# EAGLE board ebook_reader (EAGLE 9.7.0)
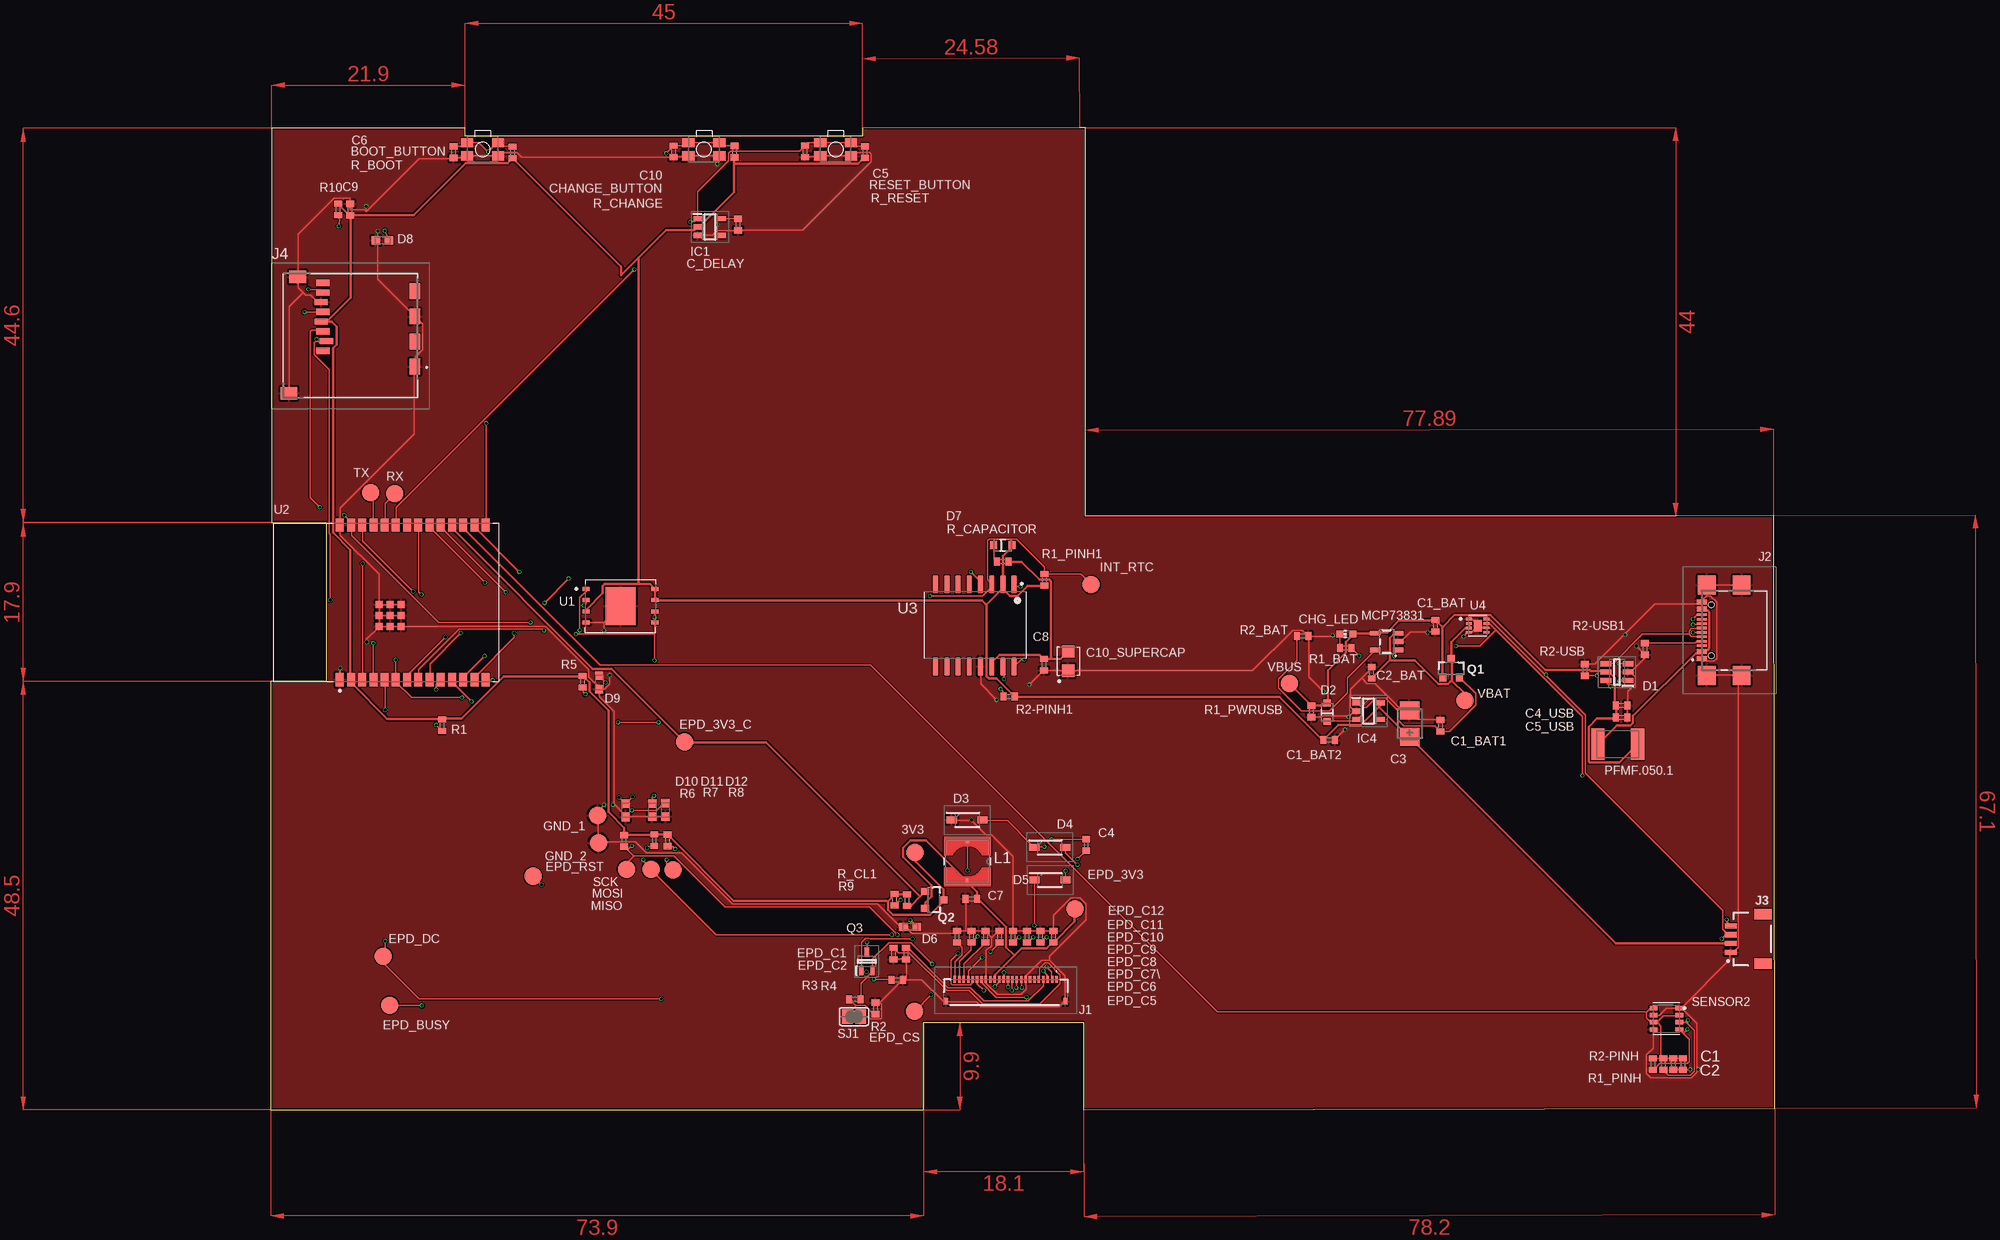
[diagram p1: board, top side]
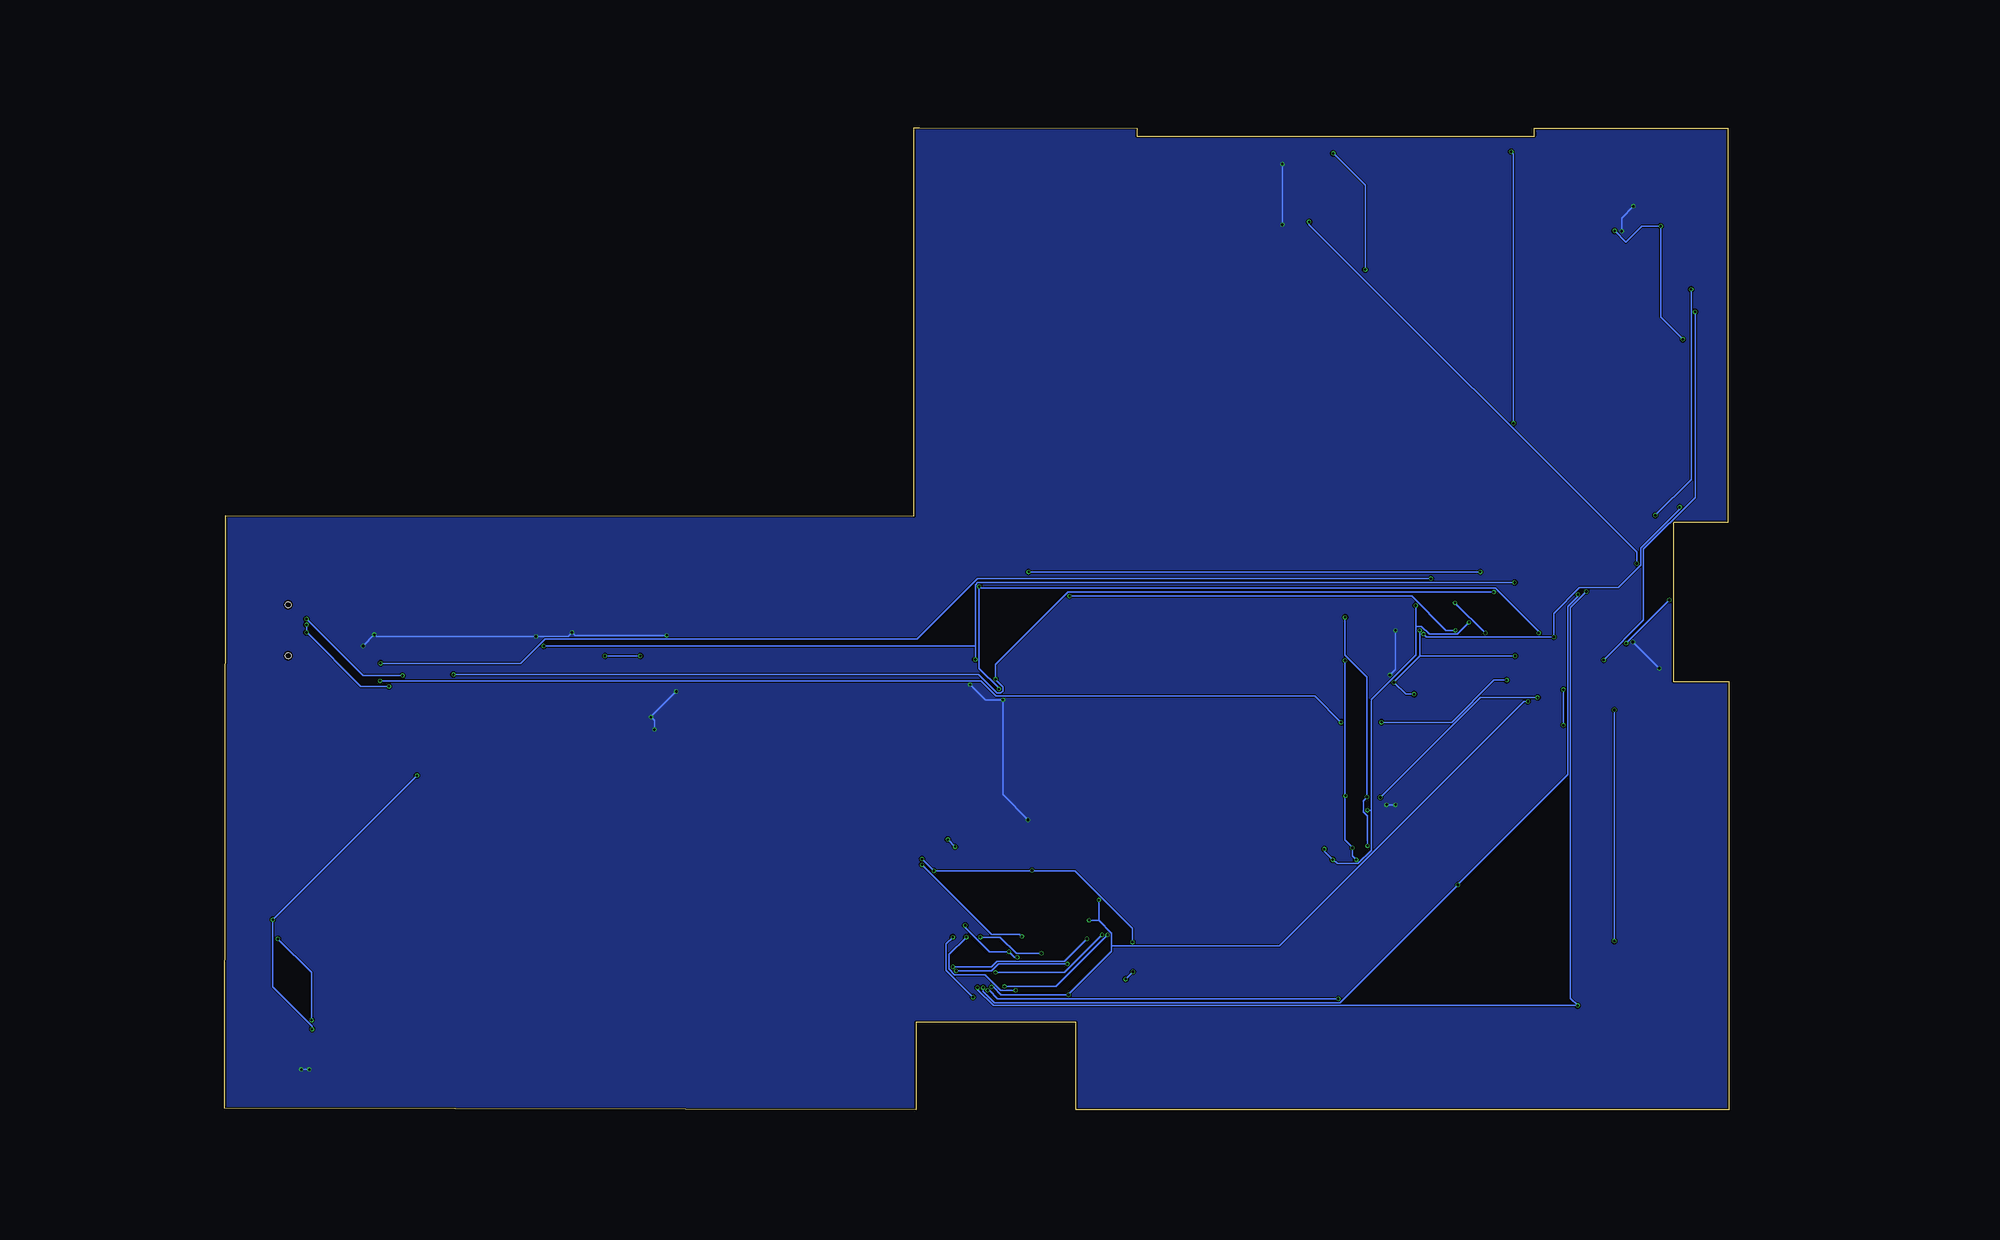
[diagram p2: board, bottom side, seen from below]

Size 170.2 x 111.2 mm. Coordinates in mm from the lower left corner, seen from the top.
Outline: 0,0 73.9,0 73.9,9.9 92,9.9 92,0 170.2,0.2 170.1,67.3 92.21,67.2 92.21,111.2 91.58,111.2 67,111.1 67,110.2 22,110.2 22,111.1 0.1,111.1 0.1,66.5 6.2,66.5 6.3,66.4 6.3,48.5 0,48.5 0,0
Copper layers (1*16): Top 0.035mm / dielectric 1.6mm / Bottom 0.035mm
Design rules "jlcpcb-2layers.dru *": minimum track width 5mil, minimum drill 0.3mm, track to track 5mil, track to pad 5mil, pad to pad 5mil, via to via 5mil, smd to smd 5mil, copper to edge 0.2mm, drill to drill 6mil, minimum pad ring 10mil, minimum via ring 3mil, stop-mask expansion 4mil, vias tented up to drill 0mil, thermal gap 10mil
Net classes: 1 NORMAL_NETS: width 0.15 mm; 2 POWER_NETS: width 0.3 mm

## Footprints (pad centres in the part's own frame; a part is rotated, then mirrored left to right if it is on the bottom)
TP20R = smd 2 x 2: TP 0,0
MYBUTTON = smd 1.4 x 1.05: 1 1.75,0.75; 2 -1.75,0.75; 3 -1.75,-0.75; 4 1.75,-0.75
ESP32_WROVER_EAGLE-LTSPICE_C0402 = smd 0.7 x 0.9: 1 -0.65,0; 2 0.65,0
RCL_CT3528 = smd 2 x 2.2: + -1.5,0; - 1.5,0
CAPCP3225X100N = smd 1.4 x 1.4: 1 -1.1,0; 2 1.1,0
ADAFRUIT_CHIP-LED0603 = smd 0.8 x 0.8: A 0,-0.75; C 0,0.75
SOT95P280X145-6N = smd 1.2 x 0.6: 1 -1.25,0.95; 2 -1.25,0; 3 -1.25,-0.95; 4 1.25,-0.95; 5 1.25,0; 6 1.25,0.95
ESP32_WROVER_AVX---SD0805S020S1R0_AVX_SD0805S020S1R0_0 = smd 0.8 x 0.9: 1 -1.05,0; 2 1.05,0
SOD3716X135N = smd 1.15 x 0.8: 1 -1.75,0; 2 1.75,0
DIOC1608X36N = smd 0.97 x 0.94: 1 -0.75,0; 2 0.75,0
SOT95P280X125-5N = smd 0.9 x 0.6: 1 -1.4,0.95; 2 -1.4,0; 3 -1.4,-0.95; 4 1.4,-0.95; 5 1.4,0.95
SOT95P280X120-5N = smd 0.9 x 0.6: 1 -1.4,0.95; 2 -1.4,0; 3 -1.4,-0.95; 4 1.4,-0.95; 5 1.4,0.95
FH34SRJ24S05SH99 = smd 0.3 x 0.8: 1 5.75,1.45; 2 5.25,1.45; 3 4.75,1.45; 4 4.25,1.45; 5 3.75,1.45; 6 3.25,1.45; 7 2.75,1.45; 8 2.25,1.45; 9 1.75,1.45; 10 1.25,1.45; 11 0.75,1.45; 12 0.25,1.45; 13 -0.25,1.45; 14 -0.75,1.45; 15 -1.25,1.45; 16 -1.75,1.45; 17 -2.25,1.45; 18 -2.75,1.45; 19 -3.25,1.45; 20 -3.75,1.45; 21 -4.25,1.45; 22 -4.75,1.45; 23 -5.25,1.45; 24 -5.75,1.45 | smd 0.4 x 0.8: MP1 6.75,-1.05; MP2 -6.75,-1.05
SAMACSYS_PARTS_USB4110GFA = smd 0.3 x 1.15: A1 -3.35,3.678; A4 -2.55,3.678; A5 -1.25,3.678; A6 -0.25,3.678; A7 0.25,3.678; A8 1.25,3.678; A9 2.55,3.678; A12 3.35,3.678; B1 3.05,3.678; B4 2.25,3.678; B5 1.75,3.678; B6 0.75,3.678; B7 -0.75,3.678; B8 -1.75,3.678; B9 -2.25,3.678; B12 -3.05,3.678 | smd 2.18 x 2: MP1 -5.11,-0.827; MP2 5.11,-0.827; MP3 -5.11,3.103; MP4 5.11,3.103 | hole 0.65: -2.89,2.603; 2.89,2.603
JST04_1MM_RA = smd 0.6 x 1.35: 1 -1.5,0; 2 -0.5,0; 3 0.5,0; 4 1.5,0 | smd 1.2 x 2: NC1 2.8,-3.675; NC2 -2.8,-3.675
112ATAARR03ATTEND = smd 1.8 x 1.2: G1 10.6,10.4; G2 4.9,10.4; S1 7.75,10.4; S2 2.05,10.4 | smd 1.4 x 1.9: G3 13.6,-3.85; G4 0.45,-2.85 | smd 0.7 x 1.5: P1 8.8,0; P2 7.7,0.4; P3 6.6,0; P4 5.5,-0.2; P5 4.4,0; P6 3.3,-0.2; P7 2.2,0; P8 1.1,0
IND_4828-WE-TPC_WRE = smd 0.381 x 0.381: 1 -2.286,0 | smd 0.762 x 0.305: 2 2.286,0
ESP32_WROVER_SPARKFUN-IC-POWER_SOT23-5 = smd 0.55 x 1.2: 1 -0.95,-1.3; 2 0,-1.3; 3 0.95,-1.3; 4 0.95,1.3; 5 -0.95,1.3
ESP32C6_VARISTOR_CT/CN1812 = smd 1.5 x 3.6: 1 -2.25,0; 2 2.25,0
ESP32_WROVER_SPARKFUN-DISCRETESEMI_SOT23-3 = smd 0.8 x 0.9: 1 -0.95,-1; 2 0.95,-1; 3 0,1.1
SOT65P210X110-3N = smd 1.05 x 0.5: 1 -1.05,0.65; 2 -1.05,-0.65; 3 1.05,0
ESP32_WROVER_EAGLE-LTSPICE_R0402 = smd 0.7 x 0.9: 1 -0.65,0; 2 0.65,0
ESP32_WROVER_BME680_PSON80P300X300X100-8N = smd 1.016 x 0.5: 1 1.458,1.2; 2 1.458,0.4; 3 1.458,-0.4; 4 1.458,-1.2; 5 -1.458,-1.22; 6 -1.458,-0.4; 7 -1.458,0.4; 8 -1.458,1.2
SJ = smd 1.168 x 1.6: 1 -0.762,0; 2 0.762,0
SON127P600X800X80-9N = smd 0.94 x 0.44: 1 -3.895,1.905; 2 -3.895,0.635; 3 -3.895,-0.635; 4 -3.895,-1.905; 5 3.895,-1.905; 6 3.895,-0.635; 7 3.895,0.635; 8 3.895,1.905 | smd 3.4 x 4.3: 9 0,0
XCVR_ESP32-C6-WROOM-1-N8 = smd 1.5 x 0.9: 1 -8.75,5.26; 2 -8.75,3.99; 3 -8.75,2.72; 4 -8.75,1.45; 5 -8.75,0.18; 6 -8.75,-1.09; 7 -8.75,-2.36; 8 -8.75,-3.63; 9 -8.75,-4.9; 10 -8.75,-6.17; 11 -8.75,-7.44; 12 -8.75,-8.71; 13 -8.75,-9.98; 14 -8.75,-11.25; 15 8.75,-11.25; 16 8.75,-9.98; 17 8.75,-8.71; 18 8.75,-7.44; 19 8.75,-6.17; 20 8.75,-4.9; 21 8.75,-3.63; 22 8.75,-2.36; 23 8.75,-1.09; 24 8.75,0.18; 25 8.75,1.45; 26 8.75,2.72; 27 8.75,3.99; 28 8.75,5.26 | smd 0.8 x 0.8: 29_1 -2.755,0.79; 29_2 -1.505,0.79; 29_3 -0.255,0.79; 29_4 -2.755,-0.46; 29_5 -1.505,-0.46; 29_6 -0.255,-0.46; 29_7 -2.755,-1.71; 29_8 -1.505,-1.71; 29_9 -0.255,-1.71
SOIC127P1032X265-16N = smd 2.05 x 0.59: 1 -4.655,4.445; 2 -4.655,3.175; 3 -4.655,1.905; 4 -4.655,0.635; 5 -4.655,-0.635; 6 -4.655,-1.905; 7 -4.655,-3.175; 8 -4.655,-4.445; 9 4.655,-4.445; 10 4.655,-3.175; 11 4.655,-1.905; 12 4.655,-0.635; 13 4.655,0.635; 14 4.655,1.905; 15 4.655,3.175; 16 4.655,4.445
SON50P200X200X80-9N = smd 0.76 x 0.27: 1 -0.985,0.75; 4 -0.985,-0.75; 5 0.985,-0.75; 6 0.985,-0.25; 7 0.985,0.25; 8 0.985,0.75 | smd 0.762 x 0.305: 2 -0.985,0.25; 3 -0.985,-0.25 | smd 0.9 x 1.3: 9 0,0

## Placement (x,y rotation side)
3V3  TPTP20R  [TP20R]  72.9,29.16 0 top
BOOT_BUTTON  BUTTON_CUSYOMV1  [MYBUTTON]  23.99,108.72 180 top
C1  100nF  [ESP32_WROVER_EAGLE-LTSPICE_C0402]  159.82,5.2 270 top
C1_BAT  4.7 uF  [ESP32_WROVER_EAGLE-LTSPICE_C0402]  131.8,54.8 270 top
C1_BAT1  4.7 uF  [ESP32_WROVER_EAGLE-LTSPICE_C0402]  132.4,43.5 90 top
C1_BAT2  4.7 uF  [ESP32_WROVER_EAGLE-LTSPICE_C0402]  119.8,41.9 0 top
C2  100nF  [ESP32_WROVER_EAGLE-LTSPICE_C0402]  158.73,5.18 270 top
C2_BAT  4.7 uF  [ESP32_WROVER_EAGLE-LTSPICE_C0402]  124.6,49.5 90 top
C3  100uF TANT  [RCL_CT3528]  128.9,43.71 90 top
C4  4.7uF/25V  [ESP32_WROVER_EAGLE-LTSPICE_C0402]  92.3,30 270 top
C4_USB  100nF  [ESP32_WROVER_EAGLE-LTSPICE_C0402]  152.9,45.8 0 top
C5  1uF  [ESP32_WROVER_EAGLE-LTSPICE_C0402]  60.5,108.5 270 top
C5_USB  4.7uF  [ESP32_WROVER_EAGLE-LTSPICE_C0402]  152.9,44.4 0 top
C6  100nF  [ESP32_WROVER_EAGLE-LTSPICE_C0402]  20.7,108.4 270 top
C7  10 uF  [ESP32_WROVER_EAGLE-LTSPICE_C0402]  79.3,23.9 180 top
C8  100nF  [ESP32_WROVER_EAGLE-LTSPICE_C0402]  87.5,50.4 270 top
C9  100 nF  [ESP32_WROVER_EAGLE-LTSPICE_C0402]  9,101.9 90 top
C10  100nF  [ESP32_WROVER_EAGLE-LTSPICE_C0402]  45.6,108.5 270 top
C10_SUPERCAP  CPH3225A  [CAPCP3225X100N]  90.26,50.79 90 top
C_DELAY  100nF  [ESP32_WROVER_EAGLE-LTSPICE_C0402]  52.9,100.2 270 top
CHANGE_BUTTON  BUTTON_CUSYOMV1  [MYBUTTON]  49.04,108.72 180 top
CHG_LED  [ADAFRUIT_CHIP-LED0603]  121.75,53.86 90 top
D1  USBLC6-2SC6Y  [SOT95P280X145-6N]  152.36,49.56 180 top
D2  ESP32_WROVER_AVX---SD0805S020S1R0_AVX_SD0805S020S1R0_0_0AVX_SD0805S020S1R0_0_0  [ESP32_WROVER_AVX---SD0805S020S1R0_AVX_SD0805S020S1R0_0]  119.57,45.01 90 top
D3  MBR0530  [SOD3716X135N]  78.83,32.82 0 top
D4  MBR0530  [SOD3716X135N]  88.17,29.72 0 top
D5  MBR0530  [SOD3716X135N]  88.21,26.02 0 top
D6  PGB1010603MR  [DIOC1608X36N]  72.37,20.72 0 top
D7  ESP32_WROVER_AVX---SD0805S020S1R0_AVX_SD0805S020S1R0_0_0AVX_SD0805S020S1R0_0_0  [ESP32_WROVER_AVX---SD0805S020S1R0_AVX_SD0805S020S1R0_0]  82.86,63.93 0 top
D8  PGB1010603MR  [DIOC1608X36N]  12.65,98.42 0 top
D9  PGB1010603MR  [DIOC1608X36N]  37.18,48.39 90 top
D10  PGB1010603MR  [DIOC1608X36N]  40.18,33.91 90 top
D11  PGB1010603MR  [DIOC1608X36N]  43.18,33.93 90 top
D12  PGB1010603MR  [DIOC1608X36N]  44.68,33.95 90 top
EPD_3V3  TPTP20R  [TP20R]  91.05,22.76 0 top
EPD_3V3_C  TPTP20R  [TP20R]  46.85,41.66 0 top
EPD_BUSY  TPTP20R  [TP20R]  13.49,11.84 0 top
EPD_C1  1uF/50V  [ESP32_WROVER_EAGLE-LTSPICE_C0402]  71.9,17.7 90 top
EPD_C2  1uF/50V  [ESP32_WROVER_EAGLE-LTSPICE_C0402]  70.5,17.7 90 top
EPD_C5  1uF/50V  [ESP32_WROVER_EAGLE-LTSPICE_C0402]  88.6,19.6 270 top
EPD_C6  1uF/50V  [ESP32_WROVER_EAGLE-LTSPICE_C0402]  87.1,19.6 270 top
EPD_C7\  1uF/50V  [ESP32_WROVER_EAGLE-LTSPICE_C0402]  85.6,19.6 270 top
EPD_C8  1uF/50V  [ESP32_WROVER_EAGLE-LTSPICE_C0402]  84,19.6 270 top
EPD_C9  1uF/50V  [ESP32_WROVER_EAGLE-LTSPICE_C0402]  82.5,19.6 270 top
EPD_C10  1uF/50V  [ESP32_WROVER_EAGLE-LTSPICE_C0402]  80.9,19.6 270 top
EPD_C11  1uF/50V  [ESP32_WROVER_EAGLE-LTSPICE_C0402]  79.3,19.6 270 top
EPD_C12  1uF/50V  [ESP32_WROVER_EAGLE-LTSPICE_C0402]  77.7,19.6 270 top
EPD_CS  TPTP20R  [TP20R]  72.85,11.16 0 top
EPD_DC  TPTP20R  [TP20R]  12.74,17.4 0 top
EPD_RST  TPTP20R  [TP20R]  29.7,26.46 0 top
GND_1  TPTP20R  [TP20R]  36.99,33.34 0 top
GND_2  TPTP20R  [TP20R]  37.11,30.24 0 top
IC1  BD5229G-TR  [SOT95P280X125-5N]  49.71,99.94 0 top
IC4  XC6220A331MR-G  [SOT95P280X120-5N]  124.25,45.14 0 top
INT_RTC  TPTP20R  [TP20R]  92.85,59.46 0 top
J1  FH34SRJ-24S-0.5SH_99_  [FH34SRJ24S05SH99]  83.19,13.32 0 top
J2  SAMACSYS_PARTS_USB4110-GF-A  [SAMACSYS_PARTS_USB4110GFA]  165.64,54.29 90 top
J3  QWIIC_RIGHT_ANGLE  [JST04_1MM_RA]  165.22,19.34 90 top
J4  112A-TAAR-R03_ATTEND  [112ATAARR03ATTEND]  5.92,94.72 270 top
L1  68uH  [IND_4828-WE-TPC_WRE]  78.85,28.13 270 top
MCP73831  ESP32_WROVER_SPARKFUN-IC-POWER_MCP73831  [ESP32_WROVER_SPARKFUN-IC-POWER_SOT23-5]  126.3,53 90 top
MISO  TPTP20R  [TP20R]  45.53,27.14 0 top
MOSI  TPTP20R  [TP20R]  43.05,27.24 0 top
PFMF.050.1  ESP32C6_VARISTORCN1812  [ESP32C6_VARISTOR_CT/CN1812]  152.44,41.4 0 top
Q1  20V/4.2A/52mΩ/1.4W  [ESP32_WROVER_SPARKFUN-DISCRETESEMI_SOT23-3]  133.6,49.96 0 top
Q2  20V/4.2A/52mΩ/1.4W  [ESP32_WROVER_SPARKFUN-DISCRETESEMI_SOT23-3]  75.06,23.78 270 top
Q3  SI1308EDL-T1-GE3  [SOT65P210X110-3N]  67.47,16.81 90 top
R1  10k  [ESP32_WROVER_EAGLE-LTSPICE_R0402]  19.4,43.56 90 top
R1_BAT  200  [ESP32_WROVER_EAGLE-LTSPICE_R0402]  121.65,52.28 0 top
R1_PINH  10k  [ESP32_WROVER_EAGLE-LTSPICE_R0402]  157.6,5.2 90 top
R1_PINH1  10k  [ESP32_WROVER_EAGLE-LTSPICE_R0402]  87.58,60.01 270 top
R1_PWRUSB  100k  [ESP32_WROVER_EAGLE-LTSPICE_R0402]  117.8,45.1 90 top
R2  2.2  [ESP32_WROVER_EAGLE-LTSPICE_R0402]  68.46,11.49 270 top
R2-PINH  10k  [ESP32_WROVER_EAGLE-LTSPICE_R0402]  156.4,5.18 90 top
R2-PINH1  10k  [ESP32_WROVER_EAGLE-LTSPICE_R0402]  83.57,46.78 0 top
R2-USB  5k1  [ESP32_WROVER_EAGLE-LTSPICE_R0402]  148.72,49.79 90 top
R2-USB1  5k1  [ESP32_WROVER_EAGLE-LTSPICE_R0402]  155.52,52.17 90 top
R2_BAT  2k  [ESP32_WROVER_EAGLE-LTSPICE_R0402]  116.8,53.64 180 top
R3  0.47  [ESP32_WROVER_EAGLE-LTSPICE_R0402]  66.12,12.5 0 top
R4  10k  [ESP32_WROVER_EAGLE-LTSPICE_R0402]  70.91,14.74 180 top
R5  10k  [ESP32_WROVER_EAGLE-LTSPICE_R0402]  35.32,48.47 90 top
R6  10k  [ESP32_WROVER_EAGLE-LTSPICE_R0402]  40.02,30.45 90 top
R7  10k  [ESP32_WROVER_EAGLE-LTSPICE_R0402]  43.42,30.53 90 top
R8  10k  [ESP32_WROVER_EAGLE-LTSPICE_R0402]  44.92,30.51 90 top
R9  10k  [ESP32_WROVER_EAGLE-LTSPICE_R0402]  70.62,23.79 90 top
R10  10k  [ESP32_WROVER_EAGLE-LTSPICE_R0402]  7.62,101.91 90 top
R_BOOT  10k  [ESP32_WROVER_EAGLE-LTSPICE_R0402]  27.38,108.39 270 top
R_CAPACITOR  15  [ESP32_WROVER_EAGLE-LTSPICE_R0402]  82.85,62.08 0 top
R_CHANGE  10k  [ESP32_WROVER_EAGLE-LTSPICE_R0402]  52.48,108.47 270 top
R_CL1  10k  [ESP32_WROVER_EAGLE-LTSPICE_R0402]  72.02,23.73 90 top
R_RESET  10k  [ESP32_WROVER_EAGLE-LTSPICE_R0402]  67.28,108.41 270 top
RESET_BUTTON  BUTTON_CUSYOMV1  [MYBUTTON]  63.94,108.72 180 top
RX  TPTP20R  [TP20R]  14.04,69.76 0 top
SCK  TPTP20R  [TP20R]  40.27,27.24 0 top
SENSOR2  ESP32_WROVER_BME680_BME680  [ESP32_WROVER_BME680_PSON80P300X300X100-8N]  157.97,10.33 0 top
SJ1  [SJ]  66.02,10.56 180 top
TX  TPTP20R  [TP20R]  11.31,69.86 0 top
U1  W25Q512JVEIQ  [SON127P600X800X80-9N]  39.59,57.06 0 top
U2  ESP32-C6-WROOM-1-N8  [XCVR_ESP32-C6-WROOM-1-N8]  13.08,57.45 90 top
U3  DS3231SN#  [SOIC127P1032X265-16N]  79.7,54.85 270 top
U4  MAX17048G+T10  [SON50P200X200X80-9N]  136.6,54.82 0 top
VBAT  TPTP20R  [TP20R]  135.16,46.36 0 top
VBUS  TPTP20R  [TP20R]  115.3,48.26 0 top

## Tracks (layer width: path | path; a pad name or v marks a point on that pad's centre or on a via)
3V3
  Top 0.3: R_CL1.2 70.67,24.38 R9.2 70.55,24.32 69.85,23.62 | 3V3.TP 72.96,29.15 72.96,28.13 76.14,24.96 76.14,23.81 Q2.3 76.2,23.69 74.61,22.1 70.42,22.1 69.85,22.67 69.85,23.62 | 69.85,23.62 69.72,23.69 52.39,23.69 45.02,31.05 R8.2 44.9,31.18 43.56,31.18 R7.2 43.37,31.18 43.31,31.11 40.07,31.11 R6.2 40.01,31.24 40.01,31.94 38.23,33.72 38.23,45.21 36.07,47.37 36.07,48.39 35.43,49.02 R5.2 35.31,49.09 26.35,49.09 21.59,44.32 19.49,44.32 R1.2 19.37,44.26 13.21,44.26 9.14,48.32 9.14,48.64 U2.2 9.02,48.83 9.02,63.37 7.05,65.34 7.05,86.23 7.45,86.63 7.45,88.69 6.88,89.25 6.45,89.25 6.41,89.28 | 52.45,107.12 52.45,107.76 R_CHANGE.2 | 52.45,107.12 52.45,103.89 48.51,99.95 48.32,99.95 IC1.2 47.94,99.57 44.74,99.57 41.66,96.48 | 52.45,107.12 66.48,107.12 67.12,107.76 67.25,107.76 R_RESET.2 | 6.41,89.28 5.78,89.28 J4.P4 | 6.41,89.28 9.08,91.95 9.08,101.18 C9.1 | 41.66,59.5 42.93,59.5 43.43,58.99 U1.8 43.5,58.86 43.5,57.72 U1.7 43.62,57.66 80.52,57.66 80.9,57.28 81.03,57.21 | 41.66,59.5 37.78,59.5 37.59,59.31 37.59,58.48 35.75,56.64 35.75,56.45 U1.3 | 81.03,57.21 81.03,49.09 81.28,48.83 82.17,48.83 84.2,46.8 R2-PINH1.2 84.33,46.74 114.17,46.74 119,41.91 C1_BAT2.1 119.19,41.91 120.84,43.56 123.38,43.56 125.44,45.62 | 81.03,57.21 82.87,59.05 82.87,59.5 U3.2 | R1_PINH1.2 87.57,59.31 85.66,59.31 84.52,58.17 83.69,58.17 82.93,58.93 U3.2 | D7.2 83.88,63.88 83.88,63.69 82.87,62.67 82.87,59.63 U3.2 | 125.44,45.62 125.6,45.78 125.6,46.04 IC4.5 | J3.2 165.16,18.86 152.21,18.86 128.91,42.16 C3.+ 128.78,42.29 125.44,45.62 | 41.66,59.5 41.66,96.48 | C9.1 16.17,101.25 22.09,107.17 26.81,107.17 R_BOOT.2 27.5,107.63 39.66,95.47 39.66,94.48 41.66,96.48
  Top 0.3: R10.2 7.62,102.54 8.91,101.25 C9.1
32KHZ  (via drill 0.3)
  Top 0.15: v82.61,47.62 82.87,47.37 82.87,46.8 R2-PINH1.1 | v84.84,59.24 84.45,59.24 84.2,59.5 U3.1 | v21.53,53.98 18.03,50.48 18.03,48.7 U2.9
  Bottom 0.15: v82.61,47.62 82.61,47.75 84.84,49.97 v84.84,59.24 84.77,59.05 26.42,59.05 21.53,54.17 v21.53,53.98
DN
  Top 0.15: 160.53,53.85 160.78,53.59 161.93,53.59 J2.B7 | 160.53,53.85 160.53,54.23 160.78,54.48 161.93,54.48 J2.A7 | 160.53,53.85 155.26,53.85 151.96,50.55 151.13,50.55 D1.4
DP  (via drill 0.3)
  Top 0.15: v160.97,54.04 161.93,54.04 J2.A6 | v160.97,54.93 161.86,54.93 161.93,54.99 J2.B6 | v151.64,47.94 151.13,48.45 151.13,48.58 D1.6
  Bottom 0.15: v160.97,54.93 v160.97,54.04 160.91,54.04 154.81,47.94 v151.64,47.94
EPD_3V3
  Top 0.3: Q2.2 74.11,22.86 74.11,23.5 74.8,24.19 74.8,25.4 71.56,28.64 71.56,29.65 72.39,30.48 74.17,30.48 78.8,25.84 L1.2 78.93,25.72 79.95,24.7 79.95,23.94 C7.1 80.07,23.88 83.25,20.7 83.25,18.41 84.17,17.49 | J1.16 81.47,14.8 81.92,14.8 J1.15 81.98,14.92 81.98,15.3 84.17,17.49 | EPD_3V3.TP 91,22.73 91,21.34 88.65,18.99 EPD_C5.2 88.46,18.92 87.82,18.29 84.96,18.29 84.17,17.49
EPD_3V3_C
  Top 0.3: 73.5,24.16 74.04,24.7 Q2.1 | 73.5,24.16 72.45,23.11 72.07,23.11 R_CL1.1 | U2.18 20.57,66.17 20.57,65.79 36.45,49.91 38.61,49.91 46.8,41.72 EPD_3V3_C.TP 46.99,41.59 56.07,41.59 73.5,24.16
EPD_BUSY  (via drill 0.3)
  Top 0.15: v85.03,13.84 84.96,13.91 84.96,14.73 J1.9 | v17.11,11.81 13.5,11.81 EPD_BUSY.TP | v16.13,58.67 10.41,64.39 10.41,66.17 U2.26
  Bottom 0.15: v85.03,13.84 85.03,13.59 83.25,11.81 v17.11,11.81 17.93,12.63 17.93,56.87 v16.13,58.67
EPD_CS  (via drill 0.3)
  Top 0.15: v83.44,13.91 83.44,14.73 J1.12 | v74.74,13.02 72.9,11.18 EPD_CS.TP | v71.31,23.75 71.25,23.75 70.67,23.18 R9.1 | v72.39,21.46 73.09,20.77 D6.2 | v22.73,46.23 20.57,48.39 20.57,48.64 U2.11
  Bottom 0.15: v83.44,13.91 83.25,13.91 82.36,13.02 v74.74,13.02 74.74,13.08 69.85,17.97 69.85,18.54 | 71.31,21.46 v71.31,23.75 | 71.31,21.46 69.85,20 69.85,18.54 | 71.31,21.46 v72.39,21.46 | v22.73,46.23 23.18,46.23 50.86,18.54 69.85,18.54
EPD_DC  (via drill 0.3)
  Top 0.15: v83.88,13.53 83.88,14.73 J1.11 | v12.95,45.28 12.95,48.64 U2.5 | EPD_DC.TP 12.95,17.61 | v44.2,12.57 16.79,12.57 12.4,16.96 12.95,17.51 12.95,17.61 | v12.95,19.11 12.95,17.61
  Bottom 0.15: v83.88,13.53 83.69,13.53 82.74,12.57 v44.2,12.57 | v12.95,19.11 v12.95,45.28
EPD_RST  (via drill 0.3)
  Top 0.15: v84.39,13.84 84.39,14.73 J1.10 | v30.67,25.46 29.72,26.42 EPD_RST.TP | U2.21 16.76,66.15 16.76,58.65 v17.07,58.34
  Bottom 0.15: v84.39,13.84 84.39,13.4 83.12,12.13 44.01,12.13 v30.67,25.46 30.67,25.53 18.21,37.99 18.21,56.99 17.07,58.13 v17.07,58.34
FLASH_CS  (via drill 0.3)
  Top 0.15: v35.62,47.05 35.37,47.31 35.37,47.82 R5.1 | v37.91,48.39 37.21,49.09 D9.2 | v34.99,54.29 34.99,57.98 35.69,58.67 35.69,58.93 U1.1 | v24.19,51.37 21.84,49.02 21.84,48.7 U2.12
  Bottom 0.15: v35.62,47.05 36.58,47.05 v37.91,48.39 37.91,48.45 34.99,51.37 | 34.99,51.37 v34.99,54.29 | 34.99,51.37 v24.19,51.37
GDR  (via drill 0.3)
  Top 0.15: v87.82,16.19 88.39,15.62 88.39,14.8 J1.2 | v72.64,19.37 67.75,19.37 67.69,19.43 67.31,19.43 66.86,18.99 66.86,15.81 Q3.1 66.93,15.81 67.12,15.62 v67.44,15.62 | v68.26,14.8 70.23,14.8 R4.2
  Bottom 0.15: v87.82,16.19 83.44,16.19 82.8,16.83 75.18,16.83 v72.64,19.37 | v67.44,15.62 v68.26,14.8
GND  (via drill 0.3)
  Top 0.15: 50.55,99.5 50.04,99 48.32,99 IC1.3 | 50.55,99.5 52.9,99.5 C_DELAY.2 52.96,99.57 60.2,99.57 67.94,107.31 67.94,108.2 67.82,108.33 66.04,108.33 65.72,108.01 RESET_BUTTON.2 65.66,108.01 62.23,108.01 RESET_BUTTON.1 62.17,107.95 62.1,107.89 60.52,107.89 C5.2 | 3.69,92.51 3.11,93.09 3.11,94.23 J4.G4 3.11,94.3 3.11,99.14 7.19,103.21 9,103.21 C9.2 9,101.89 9.01,101.88 10.61,101.88 10.81,101.68 | 3.69,92.51 2.1,90.91 2.1,81.15 J4.G3 | 10.81,101.68 16.83,107.7 20.64,107.7 C6.2 22.04,107.76 22.23,107.95 BOOT_BUTTON.1 22.29,108.01 25.72,108.01 BOOT_BUTTON.2 25.78,108.01 26.1,108.33 27.88,108.33 28.38,107.82 45.53,107.82 C10.2 45.66,107.89 47.18,107.89 47.24,107.95 CHANGE_BUTTON.1 47.31,108.01 50.74,108.01 CHANGE_BUTTON.2 50.55,107.95 v50.55,107.06 | v50.55,100.2 50.55,99.5 | 37.72,55.18 35.75,55.18 U1.4 | 37.72,55.18 39.56,57.02 U1.9 | D12.1 44.64,33.21 43.24,33.21 D11.1 43.18,33.21 40.2,33.21 D10.1 40.2,33.27 38.86,34.61 | 38.86,34.61 38.86,45.09 37.21,46.74 37.21,47.62 D9.1 | v37.72,34.54 37.02,33.85 37.02,33.4 GND_1.TP 37.02,33.34 37.08,33.27 37.08,30.29 GND_2.TP 37.15,30.35 41.27,30.35 42.55,29.08 46.48,29.08 52.26,23.3 68.71,23.3 71.25,20.77 71.56,20.77 D6.1 71.63,20.7 71.88,20.7 72.58,20 77.47,20 77.66,20.19 EPD_C12.1 77.72,20.26 78.68,20.26 | v38.73,34.54 38.8,34.61 38.86,34.61 | v37.72,54.29 37.72,55.18 | v38.35,49.21 38.35,48.2 37.78,47.62 37.27,47.62 D9.1 | U2.29_9 14.73,57.21 13.59,57.21 U2.29_6 13.53,57.15 12.38,57.15 U2.29_3 | U2.29_1 12.32,54.74 12.32,55.94 U2.29_2 | U2.29_3 12.32,57.15 12.32,56.01 U2.29_2 | U2.29_1 12.38,54.74 13.53,54.74 U2.29_4 13.59,54.74 14.73,54.74 U2.29_7 14.86,54.74 31.11,54.74 36.01,49.85 36.01,49.02 37.15,47.88 37.15,47.69 D9.1
  Top 0.15: U2.29_2 12.38,55.94 13.53,55.94 U2.29_5 13.59,55.94 14.73,55.94 U2.29_8 | v7.87,49.97 7.87,48.7 U2.1 | v10.86,52.96 10.86,53.28 12.26,54.67 U2.29_1 | U2.29_3 12.26,57.21 12.26,60.64 7.87,65.02 7.87,66.17 U2.28 7.87,66.23 7.87,68.14 16.26,76.52 16.26,84.07 J4.G1 16.38,84.14 16.38,85.25 17.22,86.09 17.22,88.95 16.38,89.79 J4.G2 16.32,89.85 12.13,94.04 12.13,98.04 D8.1 12.13,98.55 v12.13,99.46 | v10.81,102.28 10.81,101.68 | EPD_C2.1 70.55,17.08 71.88,17.08 EPD_C1.1 71.94,17.02 71.94,14.73 | 71.94,14.73 R4.1 71.5,14.73 68.96,12.19 | 71.94,14.73 73.66,14.73 76.07,12.32 76.39,12.32 J1.MP2 76.45,12.26 79.88,12.26 80.45,11.68 89.22,11.68 89.85,12.32 J1.MP1 89.92,12.32 89.92,15.18 88.14,16.95 | 68.96,12.19 68.52,12.19 R2.1 | SJ1.1 66.8,10.54 67.63,10.54 67.88,10.29 69.03,10.29 69.15,10.41 69.15,11.94 68.96,12.13 68.96,12.19 | 78.68,20.26 79.25,20.26 EPD_C11.1 79.38,20.26 80.83,20.26 EPD_C10.1 80.96,20.19 81.6,19.56 | 78.68,20.26 78.68,23.88 C7.2 | 81.6,19.56 81.6,18.54 81.41,18.35 81.28,18.35 80.96,18.03 80.96,14.8 J1.17 80.96,14.73 80.96,14.35 82.23,13.08 84.9,13.08 85.47,13.65 85.47,14.73 J1.8 85.47,14.8 85.47,15.18 87.25,16.95 88.14,16.95 | EPD_C9.1 82.49,20.19 82.3,20.19 81.66,19.56 81.6,19.56 | v82.17,46.42 80.39,48.2 80.39,50.16 U3.13 | v85.85,48.13 87.44,49.72 C8.2 87.5,49.72 90.23,49.72 C10_SUPERCAP.1 90.3,49.72 111.12,49.72 115.7,54.29 116.78,54.29 117.41,53.66 R2_BAT.1 | 79.31,32.77 77.09,32.77 D3.1 | 79.31,32.77 80.96,31.11 81.6,31.11 84.01,28.7 84.01,20.32 EPD_C8.1 EPD_C7\.1 85.66,20.26 87.06,20.26 EPD_C6.1 87.12,20.26 88.58,20.26 EPD_C5.1 88.58,20.32 88.58,22.04 90.55,24 91.57,24 92.27,23.3 92.27,21.53 88.14,17.4 88.14,16.95
  Top 0.15: v79.31,32.83 79.31,32.77 | C1_BAT1.2 132.4,44.2 129.86,44.2 128.91,45.15 C3.- 128.84,45.21 128.02,45.21 124.97,48.26 124.08,48.26 123.48,48.86 | v121.6,43.05 C1_BAT2.2 | R1_PWRUSB.1 118.87,44.45 119,44.58 121.79,44.58 121.92,44.45 v121.98,44.45 122.62,45.09 122.81,45.09 IC4.2 122.62,45.15 122.17,45.59 122.17,47.56 123.48,48.86 | 123.48,48.86 124.59,49.97 124.59,50.1 C2_BAT.2 | v119.13,47.37 117.47,49.02 117.47,53.59 R2_BAT.1 | C2.2 158.75,4.57 159.77,4.57 C1.2 159.83,4.57 v160.66,4.57 | 161.42,4.57 161.42,9.78 159.7,11.49 159.45,11.49 SENSOR2.1 | 161.42,4.57 161.42,4.25 160.78,3.62 156.21,3.62 155.7,4.13 155.7,6.22 156.46,6.99 156.46,9.08 SENSOR2.5 | SENSOR2.7 156.53,10.73 157.16,10.73 157.92,11.49 159.38,11.49 SENSOR2.1 | v161.54,4.57 161.42,4.57 | SENSOR2.1 159.7,11.56 165.16,17.02 165.16,17.78 J3.1 165.29,17.84 165.54,17.84 166.12,18.41 166.12,49.15 J2.MP1 166.43,49.21 162.56,49.21 J2.MP3 162.5,49.21 161.99,49.72 161.99,50.93 J2.A1 | U4.9 136.65,54.8 135.95,54.1 135.64,54.1 U4.4 135.57,54.04 135.45,54.04 v135,53.59 | U4.1 135.64,55.56 135.95,55.56 136.65,54.86 U4.9 | U4.6 137.54,54.61 136.91,54.61 136.72,54.8 U4.9 | 130.94,54.1 128.97,54.1 127.89,53.02 127.64,53.02 MCP73831.2 | 130.94,54.1 131.76,54.1 C1_BAT.2 | v130.94,54.04 130.94,54.1 | C5_USB.2 153.54,44.45 153.54,45.78 C4_USB.2 153.61,45.85 153.61,47.37 154.43,48.2 154.43,49.02 153.92,49.53 D1.2 153.67,49.59 153.92,49.59 155.51,51.18 155.51,51.5 R2-USB1.1 155.51,51.56 v154.56,52.51 | J2.A1 161.99,50.99 161.99,51.18 J2.B12 | 153.19,53.82 156.66,57.28 161.93,57.28 J2.B1 161.99,57.4 161.99,57.59 J2.A12 161.99,57.66 162.5,58.17
  Top 0.15: 153.19,53.82 149.86,50.48 148.78,50.48 R2-USB.2 | 162.5,58.17 162.5,59.37 J2.MP4 162.56,59.44 166.43,59.44 J2.MP2 | 162.5,58.17 162.94,58.17 163.64,57.47 163.64,51.12 163.32,50.8 162.05,50.8 J2.A1 | v153.29,53.78 153.23,53.78 153.19,53.82 | v120.21,53.72 120.08,53.59 117.54,53.59 R2_BAT.1 | 3.69,92.51 3.96,92.25 4.51,92.25 5.34,91.42 J4.P6
  Bottom 0.15: v50.55,107.06 v50.55,100.2 | v38.73,34.54 v37.72,34.54 | v37.72,54.29 37.72,49.85 v38.35,49.21 | v7.87,49.97 v10.86,52.96 | v12.13,99.46 12.13,100.96 v10.81,102.28 | v85.85,48.13 84.14,46.42 v82.17,46.42 82.17,35.69 v79.31,32.83 | v121.6,43.05 121.6,44.07 v121.98,44.45 121.98,44.51 v119.13,47.37 | v161.54,4.57 v160.66,4.57 | v154.56,52.51 v153.29,53.78 153.23,53.78 153.03,53.59 v135,53.59 131.38,53.59 v130.94,54.04 130.87,54.04 130.56,53.72 v120.21,53.72
  pour Top: 6.36,48.46 6.34,48.44 6.32,48.42 0.08,48.42 0.08,0.08 73.82,0.08 73.82,9.92 73.84,9.94 73.86,9.96 73.88,9.98 92.02,9.98 92.04,9.96 92.06,9.94 92.08,9.92 92.08,0.08 170.12,0.28 170.02,67.22 92.23,67.12 92.23,67.12 92.21,67.12 92.2,67.12 92.2,67.12 92.2,67.12 92.18,67.13 92.17,67.14 92.17,67.14 92.17,67.14 92.16,67.15 92.15,67.16 92.15,67.16 92.15,67.16 92.14,67.17 92.14,67.18 92.14,67.18 92.14,67.18 92.14,67.2 92.14,67.22 92.14,67.22 92.14,111.12 91.58,111.12 67.08,111.02 67.08,110.18 67.06,110.16 67.04,110.14 67.02,110.12 21.98,110.12 21.96,110.14 21.94,110.16 21.92,110.18 21.92,111.02 0.18,111.02 0.18,66.58 6.22,66.58 6.24,66.56 6.36,66.44 6.38,66.42 6.38,48.48
  pour Bottom: 6.36,48.46 6.34,48.44 6.32,48.42 0.08,48.42 0.08,0.08 73.82,0.08 73.82,9.92 73.84,9.94 73.86,9.96 73.88,9.98 92.02,9.98 92.04,9.96 92.06,9.94 92.08,9.92 92.08,0.08 170.12,0.28 170.02,67.22 92.23,67.12 92.23,67.12 92.21,67.12 92.2,67.12 92.2,67.12 92.2,67.12 92.18,67.13 92.17,67.14 92.17,67.14 92.17,67.14 92.16,67.15 92.15,67.16 92.15,67.16 92.15,67.16 92.14,67.17 92.14,67.18 92.14,67.18 92.14,67.18 92.14,67.2 92.14,67.22 92.14,67.22 92.14,111.12 91.58,111.12 67.08,111.02 67.08,110.18 67.06,110.16 67.04,110.14 67.02,110.12 21.98,110.12 21.96,110.14 21.94,110.16 21.92,110.18 21.92,111.02 0.18,111.02 0.18,66.58 6.22,66.58 6.24,66.56 6.36,66.44 6.38,66.42 6.38,48.48
GPIO8  (via drill 0.3)
  Top 0.15: v18.73,43.56 19.37,42.93 R1.1 | v18.73,47.56 18.73,48.13 19.24,48.64 U2.10
  Bottom 0.15: v18.73,47.56 v18.73,43.56
I2C_PW
  Top 0.15: R2-PINH.2 156.4,5.84 157.54,5.84 R1_PINH.2 | R1_PINH.2 157.73,5.84 158.69,5.84 C2.1 158.88,5.84 159.77,5.84 C1.1 | 155.7,11.05 155.7,10.41 156.15,9.97 156.46,9.97 SENSOR2.6 | 155.7,11.05 156.15,11.49 156.46,11.49 SENSOR2.8 | SENSOR2.2 159.38,10.67 157.61,10.67 156.91,9.97 156.66,9.97 SENSOR2.6 | U2.17 21.84,66.17 21.84,65.79 37.27,50.35 67.88,50.35 107.12,11.11 155.57,11.11 155.7,11.05 | R1_PINH.2 157.35,5.97 157.35,9.46 156.97,9.84 SENSOR2.6
INT_RTC  (via drill 0.3)
  Top 0.15: INT_RTC.TP 92.84,59.5 91.69,60.64 87.63,60.64 R1_PINH1.1 87.57,60.71 87.57,61.47 84.39,64.64 81.34,64.64 81.15,64.45 81.15,60.01 81.6,59.56 U3.3 81.6,59.5 81.6,59.18 80.58,58.17 v74.61,58.17 | v30.92,54.29 30.8,54.42 21.34,54.42 16.76,49.85 16.76,48.7 U2.8
  Bottom 0.15: v30.92,54.29 32,54.29 35.88,58.17 v74.61,58.17
IO/BOOT  (via drill 0.3)
  Top 0.15: C6.1 20.7,109.09 21.84,109.09 22.23,109.47 BOOT_BUTTON.4 22.29,109.47 23.56,109.47 24.57,108.46 v24.64,108.46 25.72,109.54 BOOT_BUTTON.3 25.78,109.47 26.16,109.09 27.37,109.09 R_BOOT.1 | v24.38,77.72 24.38,66.23 U2.15
  Bottom 0.15: v24.38,77.72 24.38,108.2 v24.64,108.46
IO/CHANGE  (via drill 0.3)
  Top 0.15: R_CHANGE.1 52.45,109.16 51.12,109.16 CHANGE_BUTTON.3 50.74,109.47 47.31,109.47 CHANGE_BUTTON.4 47.24,109.47 46.93,109.16 45.66,109.16 C10.1 45.59,109.09 v44.77,108.27 | v41.15,95.12 14.22,68.2 14.22,66.23 U2.23
  Bottom 0.15: v41.15,95.12 41.15,104.65 v44.77,108.27
MISO  (via drill 0.3)
  Top 0.15: v45.78,29.53 45.47,29.84 44.96,29.84 R8.1 | v44.83,28.32 44.83,27.88 45.53,27.18 MISO.TP | v35.43,57.09 35.69,57.34 35.69,57.66 U1.2 | v40.89,33.91 43.69,33.91 44.45,34.67 44.64,34.67 D12.2 | v29.4,55.18 18.99,55.18 9.14,65.02 9.14,66.17 U2.27 9.08,66.23 9.08,66.55 v8.32,67.31 | J4.P7 5.57,92.88 v4.26,92.88
  Bottom 0.15: v45.78,29.53 45.78,29.27 v44.83,28.32 44.77,28.32 44.32,27.88 41.97,27.88 40.45,29.4 40.45,33.91 | 35.43,54.74 35.43,51.5 40.45,46.48 40.45,33.91 | 35.43,54.74 v35.43,57.09 | 40.45,33.91 v40.89,33.91 | v29.4,55.18 30.73,53.85 33.91,53.85 34.8,54.74 35.43,54.74 | v4.26,92.88 4.26,71.37 v8.32,67.31
MOSI  (via drill 0.3)
  Top 0.15: v81.98,13.97 82.42,14.41 82.42,14.73 J1.14 | v70.29,19.81 50.42,19.81 43.05,27.18 MOSI.TP 43.05,27.3 42.16,28.19 v42.16,28.32 | v42.61,29.65 42.8,29.84 43.37,29.84 R7.1 | v43.43,50.86 43.43,53.85 | 43.43,53.85 43.43,55.12 U1.5 | D11.2 43.18,35.37 v43.37,35.56 | v19.81,53.53 15.49,49.21 15.49,48.7 U2.7 | 43.43,53.85 v34.54,53.85 | J4.P3 5.78,88.26 4.63,88.26 4.48,88.11 4.48,69.31 v5.56,68.23
  Bottom 0.15: v81.98,13.97 76.14,13.97 v70.29,19.81 | v42.16,28.32 42.61,28.77 v42.61,29.65 42.61,29.72 43.43,30.54 43.43,35.56 | 43.43,35.56 v43.43,50.86 | v43.37,35.56 43.43,35.56 | v34.54,53.85 34.23,53.53 v19.81,53.53 19.81,56.2 16.9,59.12 12.51,59.12 9.97,61.66 9.97,63.63 5.56,68.04 v5.56,68.23
N$1
  Top 0.15: R2-USB1.2 155.57,52.83 161.23,52.83 161.42,53.02 161.93,53.02 J2.A5
N$3
  Top 0.15: D2.1 119.57,44.01 122.68,44.01 122.81,44.13 IC4.3 122.87,44.26 123.06,44.26 123.51,44.7 123.51,45.53 | 123.51,45.53 123,46.04 122.87,46.04 IC4.1 | Q1.2 136.4,47.12 136.4,45.85 133.41,42.86 132.46,42.86 C1_BAT1.1 132.33,42.86 131.76,43.43 128.27,43.43 127.57,44.13 127.57,45.21 126.17,46.61 125.09,46.61 124.02,45.53 123.51,45.53
N$4  (via drill 0.3)
  Top 0.15: v88.39,30.61 92.27,30.61 C4.1 | v87.57,29.78 86.42,29.78 D4.1 86.36,29.78 83.38,32.77 80.58,32.77 D3.2
  Bottom 0.15: v87.57,29.78 v88.39,30.61
N$5  (via drill 0.3)
  Top 0.15: v123.19,51.37 122.3,52.26 R1_BAT.2 | v127.19,51.37 127.19,51.63 127.57,52.01 MCP73831.1
  Bottom 0.15: v127.19,51.37 v123.19,51.37
N$6
  Top 0.15: CHG_LED.C 121.03,53.85 121.03,52.32 R1_BAT.1
N$7
  Top 0.15: IC1.5 52.9,100.9 C_DELAY.1
N$9
  Top 0.15: R2_BAT.2 116.14,53.59 116.14,50.86 114.05,48.77 114.05,47.75 116.65,45.15 119.83,45.15 121.86,47.18 121.86,48.9 124.97,52.01 MCP73831.5
N$10  (via drill 0.3)
  Top 0.15: v150.11,49.15 148.78,49.15 R2-USB.1 | v160.97,55.56 161.42,56.01 161.93,56.01 J2.B5
  Bottom 0.15: v150.11,49.15 154.56,49.15 v160.97,55.56
N$11
  Top 0.15: J1.4 87.44,14.73 87.44,14.03 85.72,12.32 80.71,12.32 79.18,13.84 76.64,13.84 72.2,18.29 71.94,18.29 EPD_C1.2
N$12
  Top 0.15: J1.5 87,14.8 87,16 87.63,16.64 88.01,16.64 89.34,15.3 89.34,14.29 87.06,12 80.58,12 79.06,13.53 76.52,13.53 72.26,17.78 71.06,17.78 70.55,18.29 EPD_C2.2
N$13
  Top 0.15: D7.1 81.85,63.88 81.85,62.42 82.17,62.1 R_CAPACITOR.1
N$23  (via drill 0.3)
  Top 0.15: v85.53,12.76 82.11,12.76 80.45,14.41 80.45,14.73 J1.18 | v87.82,19.56 87.69,19.56 87.12,18.99 EPD_C6.2
  Bottom 0.15: v85.53,12.76 88.58,15.81 88.58,18.8 v87.82,19.56
N$24  (via drill 0.3)
  Top 0.15: v80.71,13.53 79.95,14.29 79.95,14.73 J1.19 | v86.3,19.56 85.66,18.92 EPD_C7\.2
  Bottom 0.15: v80.71,13.53 82.42,13.53 84.2,15.3 87.63,15.3 88.27,15.94 88.27,17.59 v86.3,19.56
N$25  (via drill 0.3)
  Top 0.15: v77.79,17.72 77.03,16.95 77.03,14.29 77.15,14.16 79.18,14.16 79.44,14.41 79.44,14.73 J1.20 | v84.71,19.56 84.58,19.56 84.01,18.99 EPD_C8.2
  Bottom 0.15: v77.79,17.72 80.64,17.72 82.49,19.56 v84.71,19.56
N$27
  Top 0.15: J1.22 78.49,14.8 78.49,16.51 80.9,18.92 EPD_C10.2
N$29
  Top 0.15: J1.24 77.47,14.8 77.47,16.76 78.23,17.53 78.23,18.41 77.72,18.92 EPD_C12.2
PREVGH  (via drill 0.3)
  Top 0.15: v80.52,17.27 78.99,15.75 78.99,14.8 J1.21 | v81.47,17.91 82.49,18.92 EPD_C9.2 | v86.42,20.89 86.42,25.97 D5.1
  Bottom 0.15: v80.52,17.27 80.83,17.27 v81.47,17.91 83.69,17.91 86.42,20.64 v86.42,20.89
PREVGL  (via drill 0.3)
  Top 0.15: J1.23 77.98,14.8 77.98,16.83 79.25,18.1 79.25,18.92 EPD_C11.2 79.31,18.92 v80.01,19.62 | v91.31,27.75 89.98,29.08 89.98,29.72 D4.2
  Bottom 0.15: v91.31,27.75 83.44,19.88 80.26,19.88 v80.01,19.62
RESE  (via drill 0.3)
  Top 0.15: v87.44,15.75 87.88,15.3 87.88,14.8 J1.3 | v74.87,16.51 72.45,18.92 69.98,18.92 68.14,17.08 68.14,15.81 Q3.2 68.14,15.68 66.8,14.35 66.8,12.51 R3.2
  Bottom 0.15: v87.44,15.75 83.44,15.75 82.68,16.51 v74.87,16.51
RESE'
  Top 0.15: 66.17,11.81 67.25,11.81 68.2,10.86 68.45,10.86 R2.2 | 66.17,11.81 65.53,12.45 R3.1 | SJ1.2 65.28,10.6 65.28,10.86 66.17,11.75 66.17,11.81
RESET  (via drill 0.3)
  Top 0.15: R_RESET.1 67.25,109.09 66.1,109.09 65.72,109.47 RESET_BUTTON.3 65.66,109.47 62.23,109.47 RESET_BUTTON.4 62.17,109.47 60.77,109.47 60.52,109.22 C5.1 60.45,109.09 59.88,108.52 52.07,108.52 51.82,108.27 51.82,107.44 48.32,103.95 48.32,100.9 IC1.1 48.26,100.84 47.94,100.52 v47.5,100.52 | v10.41,61.85 10.41,48.7 U2.3
  Bottom 0.15: v10.41,61.85 10.41,63.12 47.5,100.2 v47.5,100.52
RTC_RST  (via drill 0.3)
  Top 0.15: v28.13,60.9 23.11,65.91 23.11,66.17 U2.16 | v79.25,60.9 80.33,59.82 80.33,59.56 U3.4
  Bottom 0.15: v79.25,60.9 v28.13,60.9
RX
  Top 0.15: U2.24 12.95,66.23 12.95,68.64 14.03,69.72 RX.TP
SCK  (via drill 0.3)
  Top 0.15: v83,15.56 83,14.8 J1.13 | v70.93,19.81 67.75,22.99 51.44,22.99 45.66,28.77 41.08,28.77 | 41.08,28.77 40.07,29.78 R6.1 40.45,29.46 v40.89,29.91 | SCK.TP 40.32,27.24 40.32,27.94 41.08,28.7 41.08,28.77 | v43.43,55.75 43.43,56.39 U1.6 | v40.96,35.43 40.2,34.67 D10.2 40.13,34.67 v39.43,35.37 | v21.65,46.67 15.94,46.67 14.22,48.39 14.22,48.64 U2.6 14.16,48.77 v14.16,50.93 | J4.P5 v3.84,90.32 v3.83,90.32
  Bottom 0.15: v83,15.56 75.18,15.56 v70.93,19.81 | v43.43,55.75 43.43,51.5 40.96,49.02 v40.96,35.43 40.96,35.37 41.34,34.99 41.34,33.72 40.89,33.27 v40.89,29.91 | v21.65,46.67 28.13,46.67 v39.43,35.37 | v14.16,50.93 9.65,55.44 9.65,63.5 3.82,69.33 3.82,90.3 v3.83,90.32
SCL  (via drill 0.3)
  Top 0.15: 159.86,8.67 159.45,9.08 SENSOR2.4 | 159.86,8.67 160.53,8 160.53,5.46 160.34,5.27 157.23,5.27 156.53,4.57 156.4,4.57 R2-PINH.1 | 138.65,54.32 148.46,44.51 v148.46,37.85 | 138.65,54.32 137.92,55.05 137.6,55.05 U4.7 | v164.78,21.53 164.78,21.27 165.16,20.89 J3.4 | v160.34,9.14 159.86,8.67 | v24.26,59.69 18.03,65.91 18.03,66.17 U2.20 | v85.28,50.99 84.96,50.99 84.2,50.23 U3.16 | 138.65,54.32 136.84,52.51 v134.11,52.51
  Bottom 0.15: v148.46,37.85 v164.78,21.53 164.78,13.91 160.34,9.46 v160.34,9.14 | v24.26,59.69 85.03,59.69 85.28,59.44 85.28,52.51 | v85.28,50.99 85.28,52.51 | 85.28,52.51 v134.11,52.51
SDA  (via drill 0.3)
  Top 0.15: 160.21,9.91 161.1,9.02 161.1,4.38 160.66,3.94 158.18,3.94 157.61,4.51 R1_PINH.1 | 160.21,9.91 159.45,9.91 SENSOR2.3 | 144.24,49.24 148.78,44.7 148.78,38.16 164.34,22.61 164.34,20.45 164.91,19.88 165.16,19.88 J3.3 164.78,19.94 v164.21,19.37 | 144.24,49.24 137.92,55.56 137.6,55.56 U4.8 | v160.4,10.16 160.21,9.97 160.21,9.91 | v26.61,58.61 19.3,65.91 19.3,66.17 U2.19 | v83,48.77 83,50.1 82.93,50.16 U3.15 | v144.34,49.28 144.27,49.28 144.24,49.24
  Bottom 0.15: v160.4,10.16 160.4,15.56 v164.21,19.37 | v26.61,58.61 74.8,58.61 83,50.42 v83,48.77 83,48.7 82.17,47.88 82.17,47.43 82.42,47.18 82.8,47.18 84.9,49.28 v144.34,49.28
SRC  (via drill 0.3)
  Top 0.15: v91.31,28.38 92.27,29.34 C4.2 | v89.98,27.05 89.98,26.04 D5.2 | v67.5,18.99 67.5,17.91 Q3.3 | v78.87,27.11 78.87,30.35 L1.1
  Bottom 0.15: v91.31,28.38 v89.98,27.05 78.87,27.05 | v67.5,18.99 67.5,20.57 73.98,27.05 78.87,27.05 | v78.87,27.11 78.87,27.05
SS_SD  (via drill 0.3)
  Top 0.15: D8.2 13.4,98.44 v12.93,99.5 | v7.72,100.03 7.8,100.76 R10.1 | v11.62,52.83 U2.4 | v6.73,57.72 6.73,65.15 6.6,65.28 6.6,83.82 4.95,85.47 4.95,86.84 5.09,86.97 5.57,86.97 | J4.P2 6.29,87 5.59,87 5.57,86.97 | v5.21,87.23 5.52,86.92 5.57,86.97
  Bottom 0.15: v12.93,99.5 11.64,98.21 9.82,100.03 v7.72,100.03 7.72,89.74 v5.21,87.23 | v6.73,57.72 v11.62,52.83
TX
  Top 0.15: U2.25 11.62,66.23 11.62,69.6 11.37,69.85 TX.TP
USB_D+  (via drill 0.3)
  Top 0.15: v152.65,48.58 153.61,48.58 D1.1 | v39.31,43.88 v43.88,43.88 | v25.15,48.64 24.38,48.64 U2.14
  Bottom 0.15: v152.65,48.58 84.64,48.58 82.93,46.86 46.86,46.86 v43.88,43.88 | v39.31,43.88 31.37,43.88 26.61,48.64 v25.15,48.64
USB_D-  (via drill 0.3)
  Top 0.15: v152.59,50.55 153.61,50.55 D1.3 | v30.99,57.4 v33.72,60.13 | v27.56,53.98 27.56,53.47 23.11,49.02 23.11,48.7 U2.13
  Bottom 0.15: v152.59,50.55 136.72,50.55 133.99,53.28 91.89,53.28 85.03,60.13 v33.72,60.13 | v27.56,53.98 v30.99,57.4
VBAT
  Top 0.3: 126.68,50.93 124.65,48.9 C2_BAT.1 | 126.68,50.93 126.68,53.4 127.19,53.91 127.57,53.91 MCP73831.3 | U4.2 135.64,55.05 135.64,54.61 U4.3 135.51,54.48 135.13,54.48 133.6,52.96 133.6,51.12 Q1.3 133.67,50.93 133.67,48.58 | 133.67,48.58 135.13,47.12 135.13,46.42 VBAT.TP | 126.68,50.93 126.81,50.86 129.48,50.86 132.14,48.2 133.22,48.2 133.54,48.51 133.67,48.58
VBUS
  Top 0.3: PFMF.050.1.2 154.69,41.34 152.65,39.31 149.29,39.31 149.16,39.43 149.16,43.37 150.11,44.32 152.15,44.32 C5_USB.1 152.27,44.45 152.27,45.78 C4_USB.1 152.15,45.91 152.15,48.9 151.51,49.53 151.13,49.53 D1.5 151,49.66 149.42,49.66 149.29,49.78 144.27,49.78 138.05,56.01 133.99,56.01 132.72,54.74 132.59,54.67 | VBUS.TP 115.32,48.26 117.73,45.85 R1_PWRUSB.2 117.86,45.78 119.25,45.78 119.51,46.04 D2.2 119.63,46.16 119.63,49.72 121.67,51.75 121.67,52.96 122.43,53.72 CHG_LED.A 122.56,53.91 124.97,53.91 MCP73831.4 125.09,54.04 126.36,54.04 127.7,55.37 131.7,55.37 C1_BAT.1 131.83,55.44 132.59,54.67 | 132.59,54.67 132.59,49.02 Q1.1
VRTC
  Top 0.3: 88.33,51.05 89.41,51.05 90.23,51.88 C10_SUPERCAP.2 | 88.33,51.05 C8.1 87.38,51.12 87,51.5 82.49,51.5 81.66,50.67 81.66,50.23 U3.14 | 88.33,51.05 88.33,59.82 88.14,60.01 87,60.01 84.96,62.04 83.5,62.04 R_CAPACITOR.2
VUSB
  Top 0.3: J2.A9 161.99,56.83 161.99,56.58 J2.B4 162.12,56.52 162.62,56.52 162.81,56.33 162.81,52.26 162.62,52.07 162.12,52.07 J2.B9 161.99,52.01 161.99,51.75 J2.A4 161.86,51.69 161.29,51.69 154.18,44.58 154.18,43.81 153.86,43.5 152.34,43.5 150.24,41.4 PFMF.050.1.1
(copper drawn outside any net)
  shapes: Top area x13